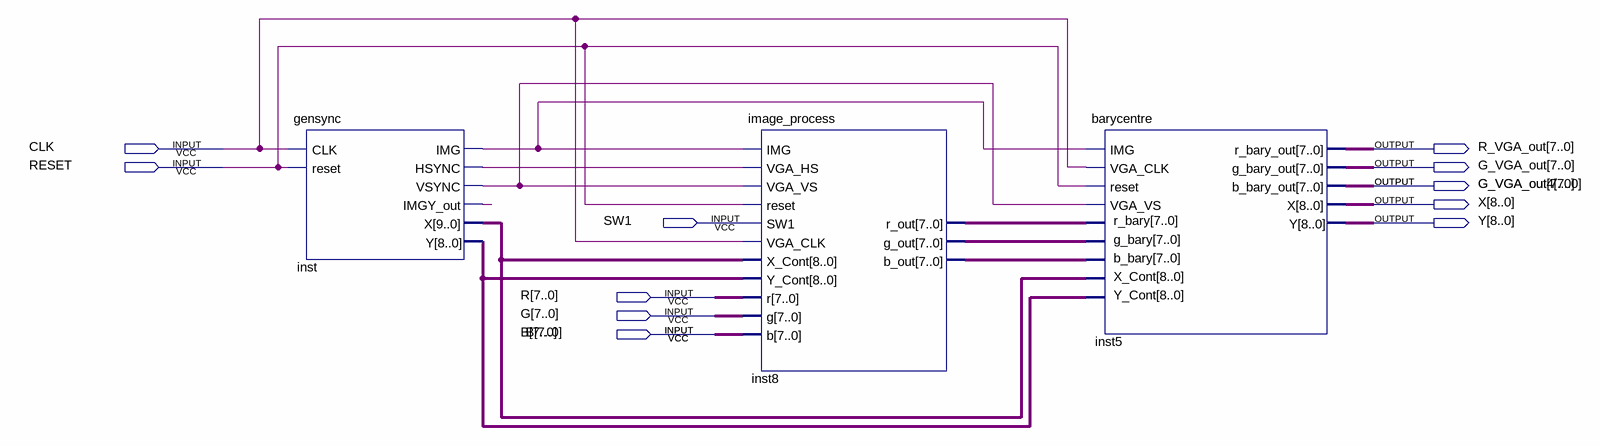
[diagram p0: schematic sheet]
// Quartus schematic Camera.bdf as structural Verilog: 3 symbols, 13 pins
module Camera (
  input  CLK,
  input  RESET,
  input  SW1,
  input  [7:0] R,
  input  [7:0] G,
  input  [7:0] B,
  output [7:0] R_VGA_out,
  output [7:0] G_VGA_out,
  output [7:0] G_VGA_out4,
  output [8:0] X,
  output [8:0] Y
);

  wire inst_hsync, inst_img, inst_imgy_out, inst_vsync;
  wire [7:0] inst8_b_out;
  wire [8:0] inst8_g_out, inst8_r_out, inst_y;
  wire [9:0] inst_x;

  gensync inst (
    .CLK(CLK), .reset(RESET), .HSYNC(inst_hsync), .VSYNC(inst_vsync), .IMG(inst_img),
    .IMGY_out(inst_imgy_out), .X(inst_x), .Y(inst_y));
  image_process inst8 (
    .IMG(inst_img), .reset(RESET), .SW1(SW1), .VGA_HS(inst_hsync), .VGA_VS(inst_vsync), .VGA_CLK(CLK),
    .X_Cont(inst_x), .Y_Cont(inst_y), .r(R), .g(G), .b(B), .r_out(inst8_r_out), .g_out(inst8_g_out),
    .b_out(inst8_b_out));
  barycentre inst5 (
    .IMG(inst_img), .reset(RESET), .VGA_CLK(CLK), .VGA_VS(inst_vsync), .X_Cont(inst8_r_out),
    .Y_Cont(inst8_g_out), .r_bary(inst8_b_out), .g_bary(inst_x), .b_bary(inst_y), .r_bary_out(R_VGA_out),
    .g_bary_out(G_VGA_out), .b_bary_out(G_VGA_out), .X(X), .Y(Y));

  assign G_VGA_out4 = G_VGA_out;
endmodule
